# EAGLE design pcb (EAGLE 6.5.0)
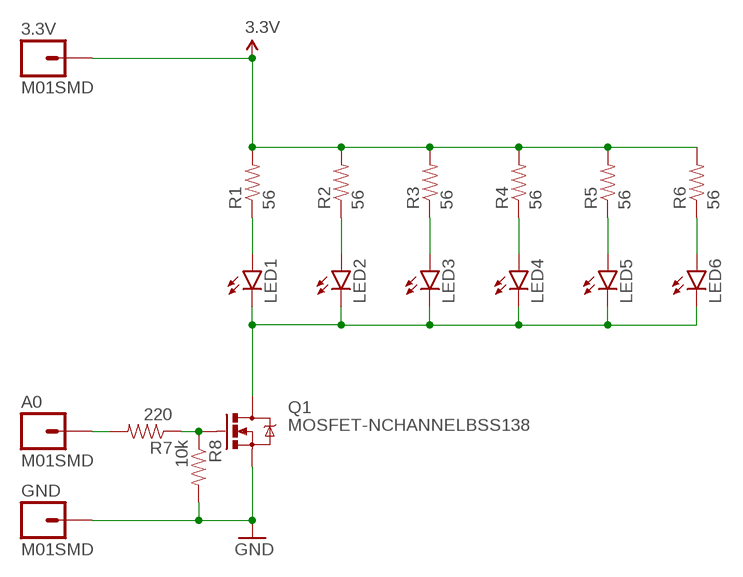
[diagram p0: schematic, sheet 1]

## Parts
3.3V  M01SMD  [LUXEON-PAD]
A0  M01SMD  [LUXEON-PAD]
GND  M01SMD  [LUXEON-PAD]
LED1  LED1206  [LED-1206]
LED2  LED1206  [LED-1206]
LED3  LED1206  [LED-1206]
LED4  LED1206  [LED-1206]
LED5  LED1206  [LED-1206]
LED6  LED1206  [LED-1206]
Q1  MOSFET-NCHANNELBSS138  [SOT23-3]
R1  56  RESISTOR0603  [0603-RES]
R2  56  RESISTOR0603  [0603-RES]
R3  56  RESISTOR0603  [0603-RES]
R4  56  RESISTOR0603  [0603-RES]
R5  56  RESISTOR0603  [0603-RES]
R6  56  RESISTOR0603  [0603-RES]
R7  220  RESISTOR0603  [0603-RES]
R8  10k  RESISTOR0603  [0603-RES]

## Nets
3.3V: 3.3V.P$1 R1.2 R2.2 R3.2 R4.2 R5.2 R6.2
GND: GND.P$1 Q1.2(S) R8.2
N$1: LED1.A R1.1
N$2: LED1.C LED2.C LED3.C LED4.C LED5.C LED6.C Q1.3(D)
N$3: A0.P$1 R7.2
N$4: Q1.1(G) R7.1 R8.1
N$5: LED2.A R2.1
N$6: LED3.A R3.1
N$7: LED4.A R4.1
N$8: LED5.A R5.1
N$9: LED6.A R6.1

## Library data of the parts
3.3V A0 GND = SparkFun-Connectors:M01: Header 1 Standard 1-pin 0.1" header. Use with straight break away headers (SKU : PRT-00116), right angle break away headers (PRT-00553), swiss pins (PRT-00743), machine pins (PRT-00117), and female headers (PRT-00115).
LED1-LED6 = SparkFun-LED:LED: LEDs Standard schematic elements and footprints for 5mm, 3mm, 1206, and 0603 sized LEDs. 5mm - Spark Fun Electronics SKU : COM-00529 (and others)
Q1 = SparkFun-DiscreteSemi:MOSFET-NCHANNEL: Common NMOSFET Parts MFG P/N Store ID Prod ID FDD8780 TRANS-09984 SI7820DN TRANS-11055 FDS6630A IC-08089 2N7002PW TRANS-11151 FQP30N06L COM-10213 TRANS-10060 BSS123LT1G TRANS-08345 BSS138 TRANS-00830 BS170 2N7000; PROD_ID: TRANS-00830
R1-R8 = SparkFun-Resistors:RESISTOR: Resistor Basic schematic elements and footprints for 0603, 1206, and PTH resistors.

## Board
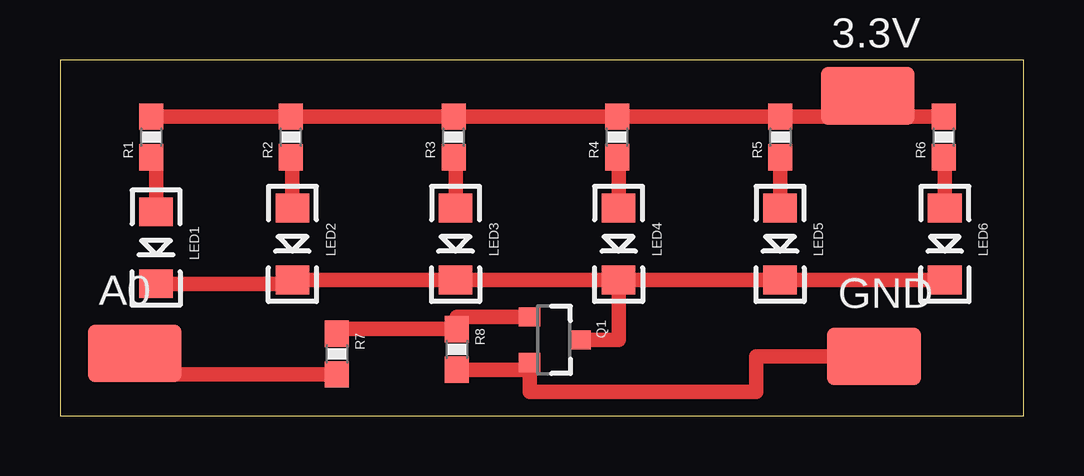
[diagram p1: board, top side]

Size 40.16 x 14.83 mm. Coordinates in mm from the lower left corner, seen from the top.
Outline: 0,0 40.16,0 40.16,14.83 0,14.83 0,0
Copper layers (1*16): Top 0.035mm / dielectric 1.5mm / Bottom 0.035mm
Design rules "default": minimum track width 10mil, minimum drill 24mil, track to track 8mil, track to pad 8mil, pad to pad 8mil, via to via 8mil, smd to smd 8mil, copper to edge 40mil, drill to drill 8mil, minimum pad ring 10mil, minimum via ring 8mil, stop-mask expansion 4mil, vias tented up to drill 0mil, thermal gap 10mil

### Footprints (pad centres in the part's own frame; a part is rotated, then mirrored left to right if it is on the bottom)
LUXEON-PAD = smd 3.9 x 2.4: P$1 0,0
LED-1206 = smd 1.2 x 1.4: A -1.5,0; C 1.5,0
SOT23-3 = smd 0.8 x 0.9: 1 -0.95,-1; 2 0.95,-1; 3 0,1.1
0603-RES = smd 1.1 x 1: 1 -0.85,0; 2 0.85,0

### Placement (x,y rotation side)
3.3V  33.66,13.34 0 top
A0  3.11,2.6 0 top
GND  33.92,2.48 0 top
LED1  4,7 270 top
LED2  9.69,7.16 270 top
LED3  16.48,7.16 270 top
LED4  23.27,7.16 270 top
LED5  30,7.16 270 top
LED6  36.87,7.16 270 top
Q1  20.57,3.16 270 top
R1  3.81,11.62 90 top
R2  9.62,11.62 90 top
R3  16.4,11.62 90 top
R4  23.21,11.62 90 top
R5  30.02,11.62 90 top
R6  36.83,11.62 90 top
R7  11.54,2.57 270 top
R8  16.54,2.76 270 top

### Tracks (layer width: path | path; a pad name or v marks a point on that pad's centre or on a via)
3.3V
  Top 0.61: R1.2 R2.2 R3.2 R4.2 R5.2 33,12.47 33,13 33.66,13 3.3V.P$1 33.66,12.47 R6.2
GND
  Top 0.61: R8.2 19.57,1.91 Q1.2 19.57,1 29,1 29,2.48 GND.P$1
N$1
  Top 0.61: R1.1 4,10.77 LED1.A
N$2
  Top 0.61: 23.21,3.16 Q1.3 23.27,3.16 LED4.C | LED1.C 9.69,5.5 LED2.C LED3.C LED4.C | LED4.C LED5.C LED6.C
N$3
  Top 0.61: R7.2 3.11,1.72 A0.P$1
N$4
  Top 0.61: Q1.1 16.54,4.11 R8.1 11.54,3.61 R7.1
N$5
  Top 0.61: R2.1 9.69,10.77 LED2.A
N$6
  Top 0.61: R3.1 16.48,10.77 LED3.A
N$7
  Top 0.61: R4.1 23.27,10.77 LED4.A
N$8
  Top 0.61: R5.1 30,10.77 LED5.A
N$9
  Top 0.61: R6.1 36.87,10.77 LED6.A